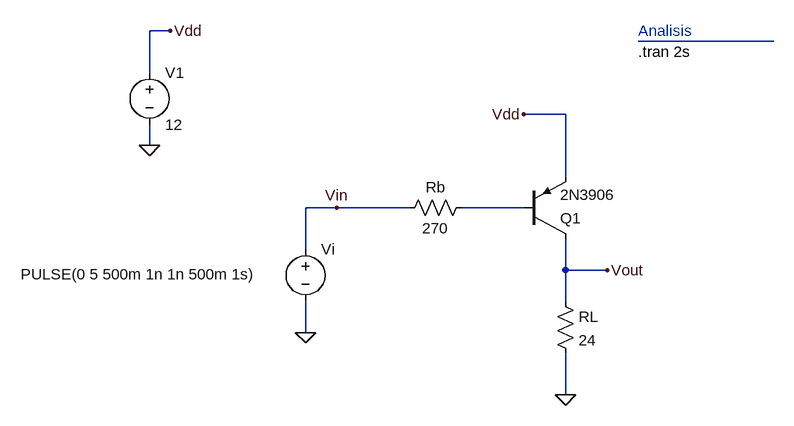
[diagram p0: schematic bjt_switch-ejemplo6-malo.asc]
bjt_switch-ejemplo6-malo.asc, the LTspice schematic file:
Version 4
SHEET 1 880 680
WIRE -528 -176 -560 -176
WIRE 400 -160 192 -160
WIRE -560 -112 -560 -176
WIRE 80 -48 16 -48
WIRE -560 0 -560 -32
WIRE 80 48 80 -48
WIRE -272 96 -320 96
WIRE -160 96 -272 96
WIRE 16 96 -80 96
WIRE -320 160 -320 96
WIRE 80 192 80 144
WIRE 144 192 80 192
WIRE 80 240 80 192
WIRE -320 288 -320 240
WIRE 80 384 80 320
FLAG 80 384 0
FLAG -560 0 0
FLAG -528 -176 Vdd
FLAG -320 288 0
FLAG 16 -48 Vdd
FLAG 144 192 Vout
FLAG -272 96 Vin
SYMBOL res -64 80 R90
WINDOW 0 0 56 VBottom 2
WINDOW 3 32 56 VTop 2
SYMATTR InstName Rb
SYMATTR Value 270
SYMBOL res 64 224 R0
SYMATTR InstName RL
SYMATTR Value 24
SYMBOL voltage -560 -128 R0
WINDOW 123 0 0 Left 0
WINDOW 39 0 0 Left 0
SYMATTR InstName V1
SYMATTR Value 12
SYMBOL voltage -320 144 R0
WINDOW 3 -438 54 Left 2
WINDOW 123 0 0 Left 0
WINDOW 39 0 0 Left 0
SYMATTR InstName Vi
SYMATTR Value PULSE(0 5 500m 1n 1n 500m 1s)
SYMBOL pnp 16 144 M180
SYMATTR InstName Q1
SYMATTR Value 2N3906
TEXT 192 -144 Left 2 !.tran 2s
TEXT 192 -176 Left 2 ;Analisis

The netlist it stands for:
* bjt_switch-ejemplo6-malo.asc
Rb N002 Vin 270
RL Vout 0 24
V1 Vdd 0 12
Vi Vin 0 PULSE(0 5 500m 1n 1n 500m 1s)
Q1 Vout N002 Vdd 0 2N3906
.model NPN NPN
.model PNP PNP
.lib standard.bjt
.tran 2s
* Analisis
.backanno
.end